# EAGLE design schem (EAGLE 7.6.0)
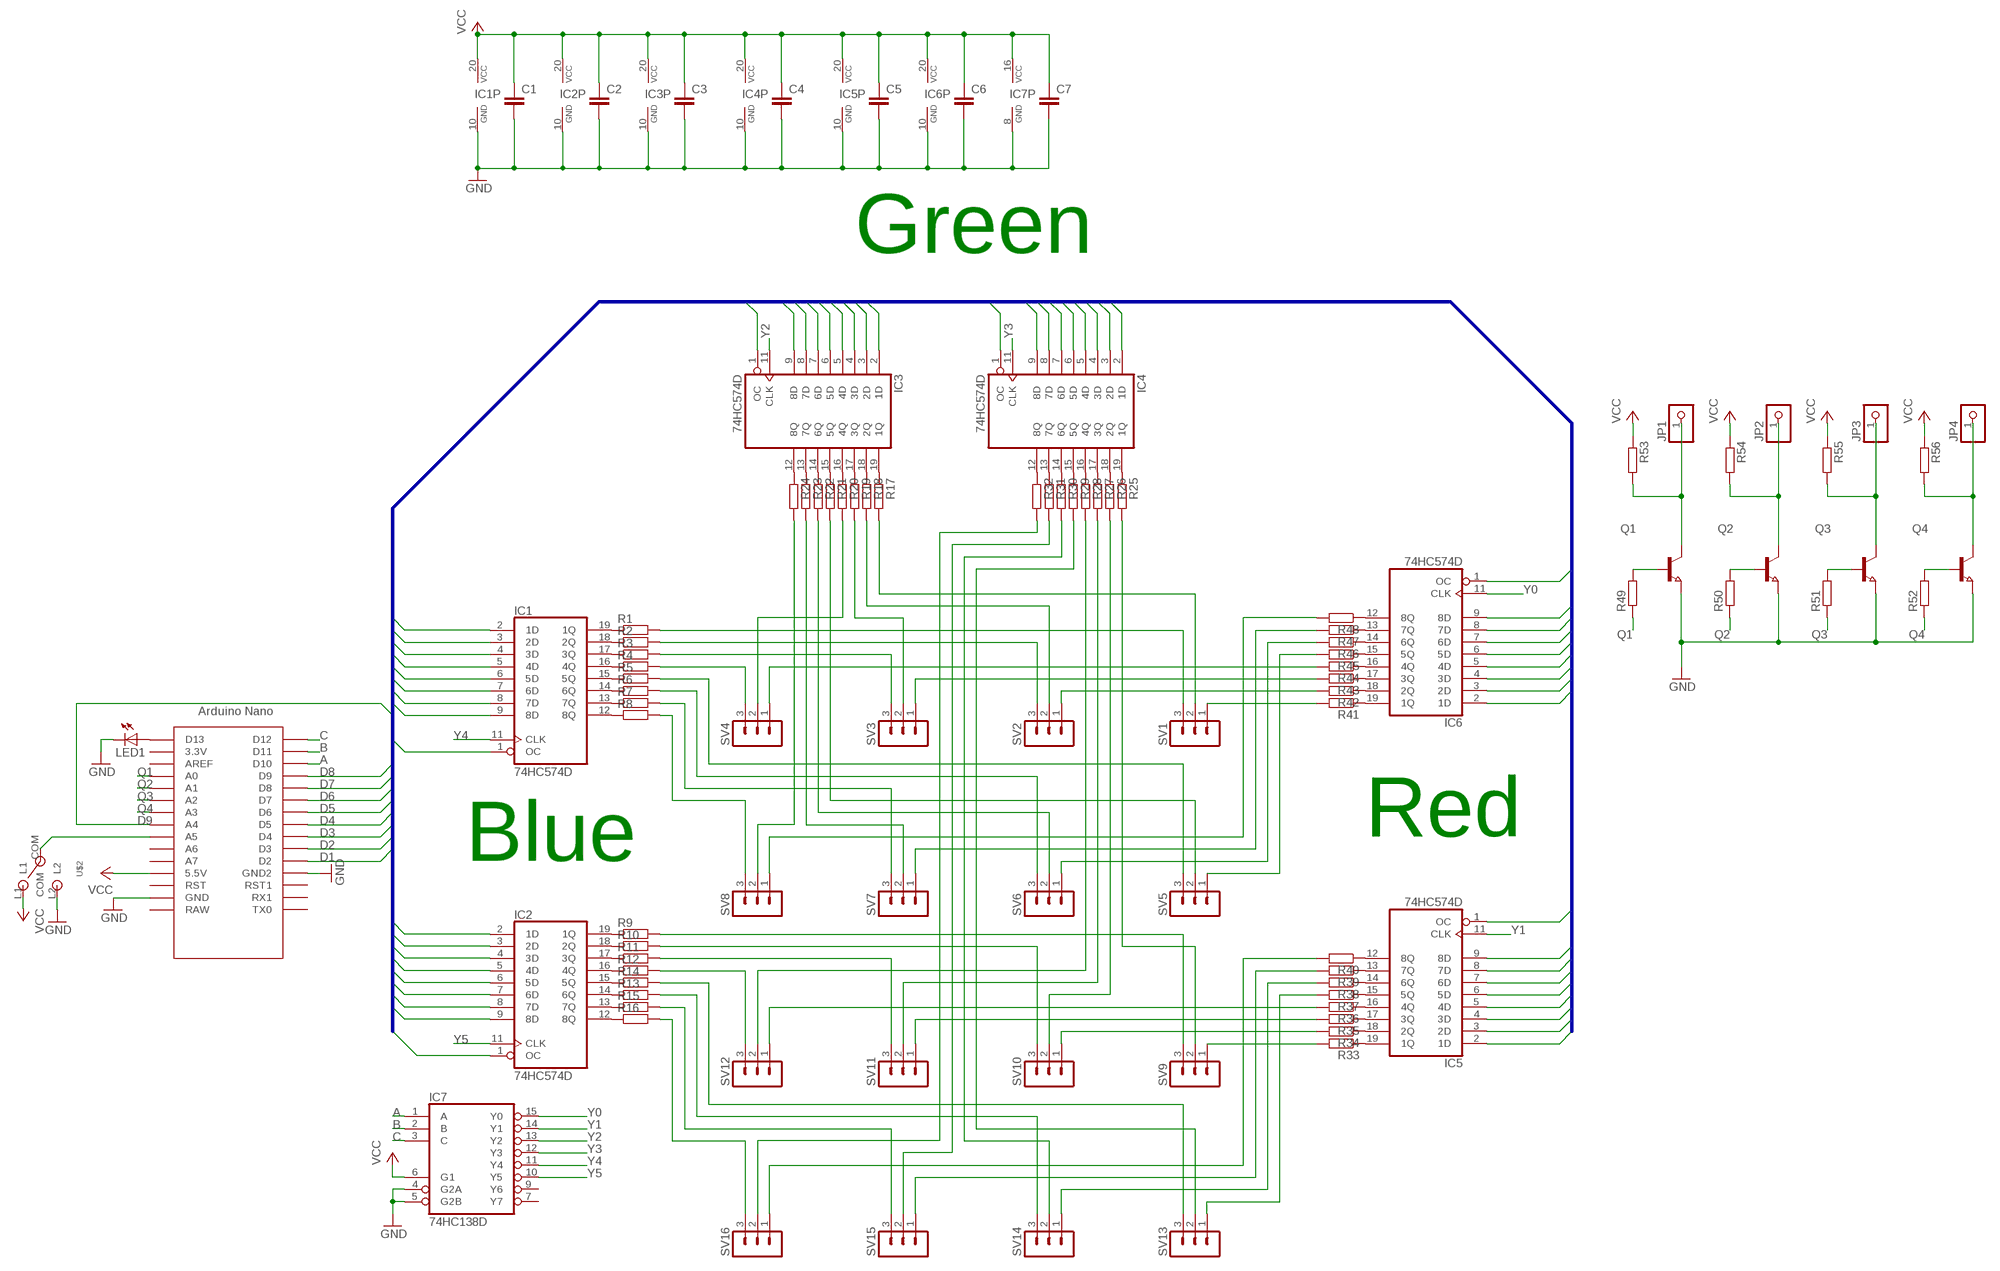
[diagram p0: schematic, sheet 1]

## Parts
C1  C-EUC0805  [C0805]
C2  C-EUC0805  [C0805]
C3  C-EUC0805  [C0805]
C4  C-EUC0805  [C0805]
C5  C-EUC0805  [C0805]
C6  C-EUC0805  [C0805]
C7  C-EUC0805  [C0805]
IC1  74HC574D  [SO20W]
IC2  74HC574D  [SO20W]
IC3  74HC574D  [SO20W]
IC4  74HC574D  [SO20W]
IC5  74HC574D  [SO20W]
IC6  74HC574D  [SO20W]
IC7  74HC138D  [SO16]
JP1  PINHD-1X1  [1X01]
JP2  PINHD-1X1  [1X01]
JP3  PINHD-1X1  [1X01]
JP4  PINHD-1X1  [1X01]
LED1  LEDCHIP-LED0805  [CHIP-LED0805]
Q1  NPN-TRANSISTOR_SOT23  [SOT23]
Q2  NPN-TRANSISTOR_SOT23  [SOT23]
Q3  NPN-TRANSISTOR_SOT23  [SOT23]
Q4  NPN-TRANSISTOR_SOT23  [SOT23]
R1  R-EU_R0805  [R0805]
R2  R-EU_R0805  [R0805]
R3  R-EU_R0805  [R0805]
R4  R-EU_R0805  [R0805]
R5  R-EU_R0805  [R0805]
R6  R-EU_R0805  [R0805]
R7  R-EU_R0805  [R0805]
R8  R-EU_R0805  [R0805]
R9  R-EU_R0805  [R0805]
R10  R-EU_R0805  [R0805]
R11  R-EU_R0805  [R0805]
R12  R-EU_R0805  [R0805]
R13  R-EU_R0805  [R0805]
R14  R-EU_R0805  [R0805]
R15  R-EU_R0805  [R0805]
R16  R-EU_R0805  [R0805]
R17  R-EU_R0805  [R0805]
R18  R-EU_R0805  [R0805]
R19  R-EU_R0805  [R0805]
R20  R-EU_R0805  [R0805]
R21  R-EU_R0805  [R0805]
R22  R-EU_R0805  [R0805]
R23  R-EU_R0805  [R0805]
R24  R-EU_R0805  [R0805]
R25  R-EU_R0805  [R0805]
R26  R-EU_R0805  [R0805]
R27  R-EU_R0805  [R0805]
R28  R-EU_R0805  [R0805]
R29  R-EU_R0805  [R0805]
R30  R-EU_R0805  [R0805]
R31  R-EU_R0805  [R0805]
R32  R-EU_R0805  [R0805]
R33  R-EU_R0805  [R0805]
R34  R-EU_R0805  [R0805]
R35  R-EU_R0805  [R0805]
R36  R-EU_R0805  [R0805]
R37  R-EU_R0805  [R0805]
R38  R-EU_R0805  [R0805]
R39  R-EU_R0805  [R0805]
R40  R-EU_R0805  [R0805]
R41  R-EU_R0805  [R0805]
R42  R-EU_R0805  [R0805]
R43  R-EU_R0805  [R0805]
R44  R-EU_R0805  [R0805]
R45  R-EU_R0805  [R0805]
R46  R-EU_R0805  [R0805]
R47  R-EU_R0805  [R0805]
R48  R-EU_R0805  [R0805]
R49  R-EU_R0805  [R0805]
R50  R-EU_R0805  [R0805]
R51  R-EU_R0805  [R0805]
R52  R-EU_R0805  [R0805]
R53  R-EU_R0805  [R0805]
R54  R-EU_R0805  [R0805]
R55  R-EU_R0805  [R0805]
R56  R-EU_R0805  [R0805]
SV1  MA03-1  [MA03-1]
SV2  MA03-1  [MA03-1]
SV3  MA03-1  [MA03-1]
SV4  MA03-1  [MA03-1]
SV5  MA03-1  [MA03-1]
SV6  MA03-1  [MA03-1]
SV7  MA03-1  [MA03-1]
SV8  MA03-1  [MA03-1]
SV9  MA03-1  [MA03-1]
SV10  MA03-1  [MA03-1]
SV11  MA03-1  [MA03-1]
SV12  MA03-1  [MA03-1]
SV13  MA03-1  [MA03-1]
SV14  MA03-1  [MA03-1]
SV15  MA03-1  [MA03-1]
SV16  MA03-1  [MA03-1]
U$1  NANO  [NANO]
U$2  MSK-12C02_SMD_SPDT_SWITCH  [MSK-12C02]

## Nets
A: IC7.1(A) U$1.D10
B: IC7.2(B) U$1.D11
C: IC7.3(C) U$1.D12
D1: IC1.2(1D) IC2.2(1D) IC3.2(1D) IC4.2(1D) IC5.2(1D) IC6.2(1D) U$1.D2
D2: IC1.3(2D) IC2.3(2D) IC3.3(2D) IC4.3(2D) IC5.3(2D) IC6.3(2D) U$1.D3
D3: IC1.4(3D) IC2.4(3D) IC3.4(3D) IC4.4(3D) IC5.4(3D) IC6.4(3D) U$1.D4
D4: IC1.5(4D) IC2.5(4D) IC3.5(4D) IC4.5(4D) IC5.5(4D) IC6.5(4D) U$1.D5
D5: IC1.6(5D) IC2.6(5D) IC3.6(5D) IC4.6(5D) IC5.6(5D) IC6.6(5D) U$1.D6
D6: IC1.7(6D) IC2.7(6D) IC3.7(6D) IC4.7(6D) IC5.7(6D) IC6.7(6D) U$1.D7
D7: IC1.8(7D) IC2.8(7D) IC3.8(7D) IC4.8(7D) IC5.8(7D) IC6.8(7D) U$1.D8
D8: IC1.9(8D) IC2.9(8D) IC3.9(8D) IC4.9(8D) IC5.9(8D) IC6.9(8D) U$1.D9
D9: IC1.1(OC) IC2.1(OC) IC3.1(OC) IC4.1(OC) IC5.1(OC) IC6.1(OC) U$1.A4
GND: C1.2 C2.2 C3.2 C4.2 C5.2 C6.2 C7.2 IC1.10(GND) IC2.10(GND) IC3.10(GND) IC4.10(GND) IC5.10(GND) IC6.10(GND) IC7.4(G2A) IC7.5(G2B) IC7.8(GND) LED1.C Q1.2(E) Q2.2(E) Q3.2(E) Q4.2(E) U$1.GND U$1.GND1(GND2) U$2.L2
N$1: IC1.19(1Q) R1.1
N$2: IC1.18(2Q) R2.1
N$3: IC1.17(3Q) R3.1
N$4: IC1.16(4Q) R4.1
N$5: IC1.15(5Q) R5.1
N$6: IC1.14(6Q) R6.1
N$7: IC1.13(7Q) R7.1
N$8: IC1.12(8Q) R8.1
N$9: IC2.19(1Q) R9.1
N$10: IC2.18(2Q) R10.1
N$11: IC2.17(3Q) R11.1
N$12: IC2.16(4Q) R12.1
N$13: IC2.14(6Q) R13.1
N$14: IC2.15(5Q) R14.1
N$15: IC2.13(7Q) R15.1
N$16: IC2.12(8Q) R16.1
N$17: IC3.19(1Q) R17.1
N$18: IC3.18(2Q) R18.1
N$19: IC3.17(3Q) R19.1
N$20: IC3.16(4Q) R20.1
N$21: IC3.15(5Q) R21.1
N$22: IC3.14(6Q) R22.1
N$23: IC3.13(7Q) R23.1
N$24: IC3.12(8Q) R24.1
N$25: IC4.19(1Q) R25.1
N$26: IC4.18(2Q) R26.1
N$27: IC4.17(3Q) R27.1
N$28: IC4.16(4Q) R28.1
N$29: IC4.15(5Q) R29.1
N$30: IC4.14(6Q) R30.1
N$31: IC4.13(7Q) R31.1
N$32: IC4.12(8Q) R32.1
N$33: IC5.19(1Q) R33.1
N$34: IC5.18(2Q) R34.1
N$35: IC5.17(3Q) R35.1
N$36: IC5.16(4Q) R36.1
N$37: IC5.15(5Q) R37.1
N$38: IC5.14(6Q) R38.1
N$39: IC5.13(7Q) R39.1
N$40: IC5.12(8Q) R40.1
N$41: IC6.19(1Q) R41.1
N$42: IC6.18(2Q) R42.1
N$43: IC6.17(3Q) R43.1
N$44: IC6.16(4Q) R44.1
N$45: IC6.15(5Q) R45.1
N$46: IC6.14(6Q) R46.1
N$47: IC6.13(7Q) R47.1
N$48: IC6.12(8Q) R48.1
N$49: R1.2 SV1.3
N$50: R2.2 SV2.3
N$51: R3.2 SV3.3
N$52: R4.2 SV4.3
N$53: R5.2 SV5.3
N$54: R6.2 SV6.3
N$55: R7.2 SV7.3
N$56: R8.2 SV8.3
N$57: R17.2 SV1.2
N$58: R18.2 SV2.2
N$59: R19.2 SV3.2
N$60: R20.2 SV4.2
N$61: R21.2 SV5.2
N$62: R22.2 SV6.2
N$63: R23.2 SV7.2
N$64: R24.2 SV8.2
N$65: R44.2 SV4.1
N$66: R43.2 SV3.1
N$67: R42.2 SV2.1
N$68: R41.2 SV1.1
N$69: R48.2 SV8.1
N$70: R9.2 SV9.3
N$71: R47.2 SV7.1
N$72: R46.2 SV6.1
N$73: R45.2 SV5.1
N$74: R10.2 SV10.3
N$75: R11.2 SV11.3
N$76: R12.2 SV12.3
N$77: R28.2 SV12.2
N$78: R27.2 SV11.2
N$79: R26.2 SV10.2
N$80: R25.2 SV9.2
N$81: R36.2 SV12.1
N$82: R35.2 SV11.1
N$83: R34.2 SV10.1
N$84: R33.2 SV9.1
N$85: R14.2 SV13.3
N$86: R13.2 SV14.3
N$87: R15.2 SV15.3
N$88: R16.2 SV16.3
N$89: R32.2 SV16.2
N$90: R31.2 SV15.2
N$91: R30.2 SV14.2
N$92: R29.2 SV13.2
N$93: R40.2 SV16.1
N$94: R39.2 SV15.1
N$95: R38.2 SV14.1
N$96: R37.2 SV13.1
N$97: U$1.A5 U$2.COM
N$98: JP1.1 Q1.3(C) R53.2
N$99: JP2.1 Q2.3(C) R54.2
N$100: JP3.1 Q3.3(C) R55.2
N$101: JP4.1 Q4.3(C) R56.2
N$102: Q1.1(B) R49.2
N$103: Q2.1(B) R50.2
N$104: Q3.1(B) R51.2
N$105: Q4.1(B) R52.2
N$106: LED1.A U$1.D13
Q1: R49.1 U$1.A0
Q2: R50.1 U$1.A1
Q3: R51.1 U$1.A2
Q4: R52.1 U$1.A3
VCC: C1.1 C2.1 C3.1 C4.1 C5.1 C6.1 C7.1 IC1.20(VCC) IC2.20(VCC) IC3.20(VCC) IC4.20(VCC) IC5.20(VCC) IC6.20(VCC) IC7.6(G1) IC7.16(VCC) R53.1 R54.1 R55.1 R56.1 U$1.5V(5.5V) U$2.L1
Y0: IC6.11(CLK) IC7.15(Y0)
Y1: IC5.11(CLK) IC7.14(Y1)
Y2: IC3.11(CLK) IC7.13(Y2)
Y3: IC4.11(CLK) IC7.12(Y3)
Y4: IC1.11(CLK) IC7.11(Y4)
Y5: IC2.11(CLK) IC7.10(Y5)
Unconnected: IC7.7(Y7) IC7.9(Y6) U$1.3.3V U$1.A6 U$1.A7 U$1.AREF U$1.ICSP1 U$1.ICSP2 U$1.ICSP3 U$1.ICSP4 U$1.ICSP5 U$1.ICSP6 U$1.RAW U$1.RST U$1.RST1 U$1.RX1 U$1.TX0

## Buses
D[1..9]

## Notes on the sheet
- Green
- Red
- Blue

## Library data of the parts
C1-C7 = resistor:C-EU: CAPACITOR, European symbol
IC1-IC6 = 74xx-eu:74*574: 8-bit D type FLIP FLOP bus driver
IC7 = 74xx-eu:74*138: 3-line to 8-line DECODER/DEMULTIPLEXER
JP1-JP4 = pinhead:PINHD-1X1: PIN HEADER
LED1 = led:LED: LED OSRAM: - CHIPLED LG R971, LG N971, LY N971, LG Q971, LY Q971, LO R971, LY R971 LH N974, LH R974 LS Q976, LO Q976, LY Q976 LO Q996 - Hyper CHIPLED LW Q18S LB Q993, LB Q99A, LB R99A - SideLED LS A670, LO A670, LY A670, LG A670, LP A670 LB A673, LV A673, LT A673, LW A673 LH A674 LY A675 LS A676, LA A676, LO A676, LY A676, LW A676 LS A679, LY A679, LG A679 - Hyper Micro SIDELED® LS Y876, LA Y876, LO Y876, LY Y876 LT Y87S - SmartLED LW L88C, LW L88S LB L89C, LB L89S, LG L890 LS L89K, LO L89K, LY L89K LS L896, LA L896, LO L896, LY L896 - TOPLED LS T670, LO T670, LY T670, LG T670, LP T670 LSG T670, LSP T670, LSY T670, LOP T670, LYG T670 LG T671, LOG T671, LSG T671 LB T673, LV T673, LT T673, LW T673 LH T674 LS T676, LA T676, LO T676, LY T676, LB T676, LH T676, LSB T676, LW T676 LB T67C, LV T67C, LT T67C, LS T67K, LO T67K, LY T67K, LW E67C LS E67B, LA E67B, LO E67B, LY E67B, LB E67C, LV E67C, LT E67C LW T67C LS T679, LY T679, LG T679 LS T770, LO T770, LY T770, LG T770, LP T770 LB T773, LV T773, LT T773, LW T773 LH T774 LS E675, LA E675, LY E675, LS T675 LS T776, LA T776, LO T776, LY T776, LB T776 LHGB T686 LT T68C, LB T68C - Hyper Mini TOPLED® LB M676 - Mini TOPLED Santana® LG M470 LS M47K, LO M47K, LY M47K Source: http://www.osram.convergy.de LUXEON: - LUMILED® LXK2-PW12-R00, LXK2-PW12-S00, LXK2-PW14-U00, LXK2-PW14-V00 LXK2-PM12-R00, LXK2-PM12-S00, LXK2-PM14-U00 LXK2-PE12-Q00, LXK2-PE12-R00, LXK2-PE12-S00, LXK2-PE14-T00, LXK2-PE14-U00 LXK2-PB12-K00, LXK2-PB12-L00, LXK2-PB12-M00, LXK2-PB14-N00, LXK2-PB14-P00, LXK2-PB14-Q00 LXK2-PR12-L00, LXK2-PR12-M00, LXK2-PR14-Q00, LXK2-PR14-R00 LXK2-PD12-Q00, LXK2-PD12-R00, LXK2-PD12-S00 LXK2-PH12-R00, LXK2-PH12-S00 LXK2-PL12-P00, LXK2-PL12-Q00, LXK2-PL12-R00 Source: www.luxeon.com KINGBRIGHT: KA-3528ASYC Source: www.kingbright.com
Q1-Q4 = semicon-smd-ipc:NPN-TRANSISTOR_: NPN TRANSISTOR
R1-R56 = resistor:R-EU_: RESISTOR, European symbol
SV1-SV16 = con-lstb:MA03-1: PIN HEADER; OC_FARNELL: unknown; OC_NEWARK: unknown
U$1 = Arduino-clone:NANO: Arduino Nano
U$2 = MSK-12C02 SMD Micro Slider Switch SPDT:MSK-12C02_SMD_SPDT_SWITCH: Footprint of the VIMEX MSK-12C02 SPDT SMD Switch Created by mzst on 17-Jan-2016

## Board
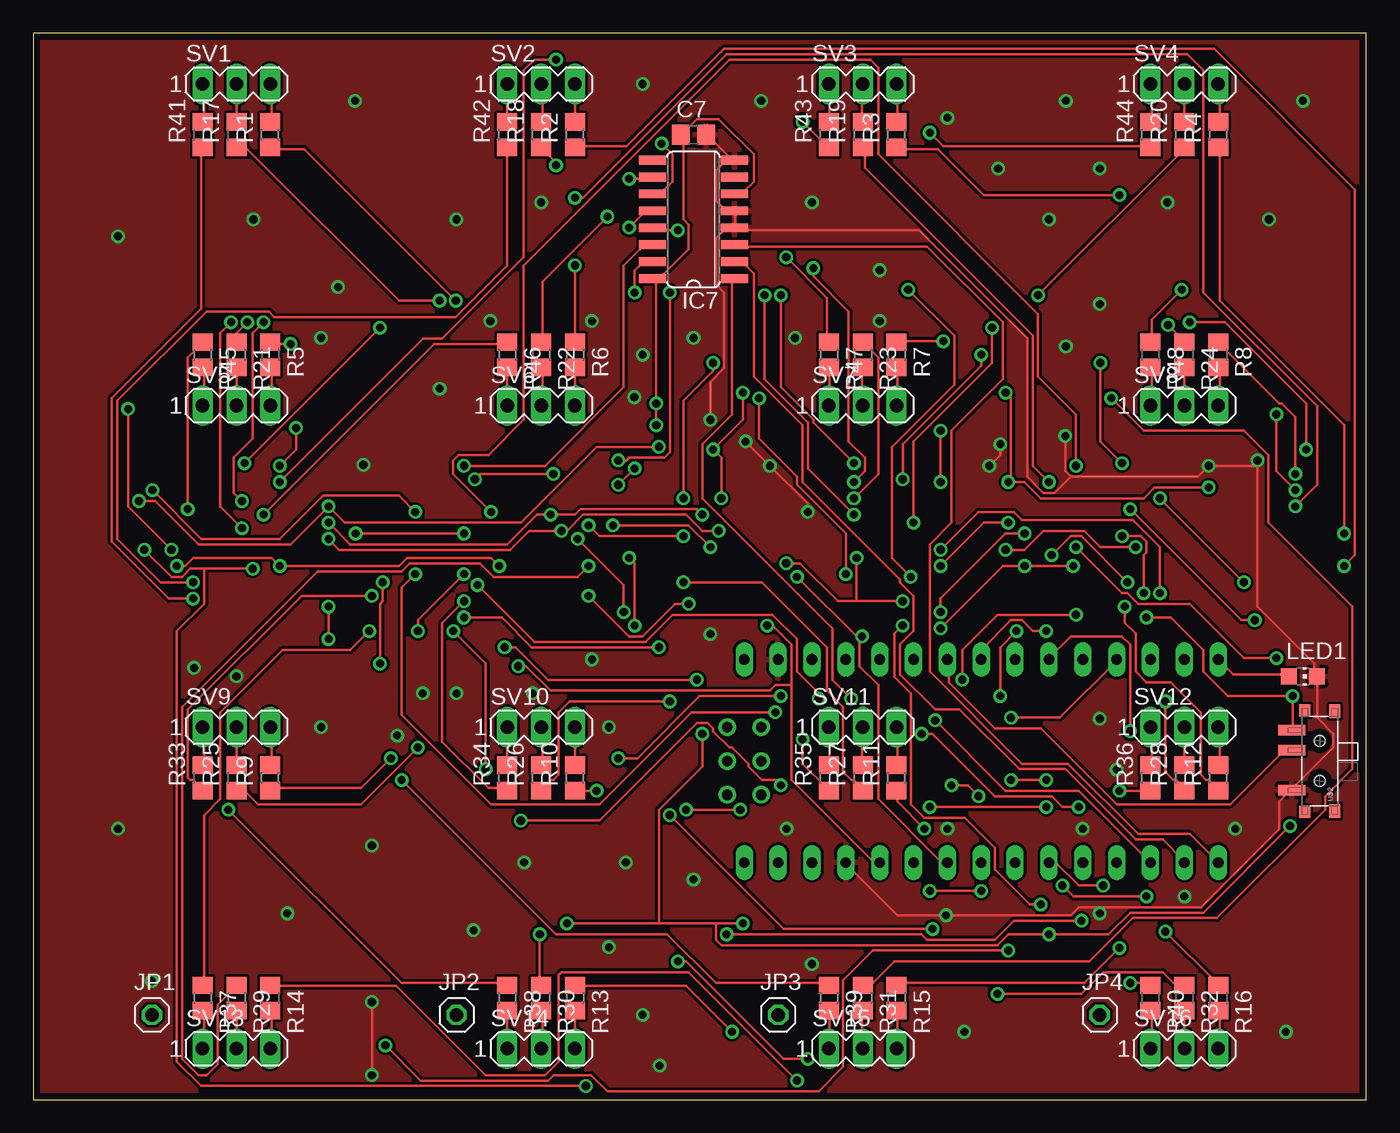
[diagram p1: board, top side]
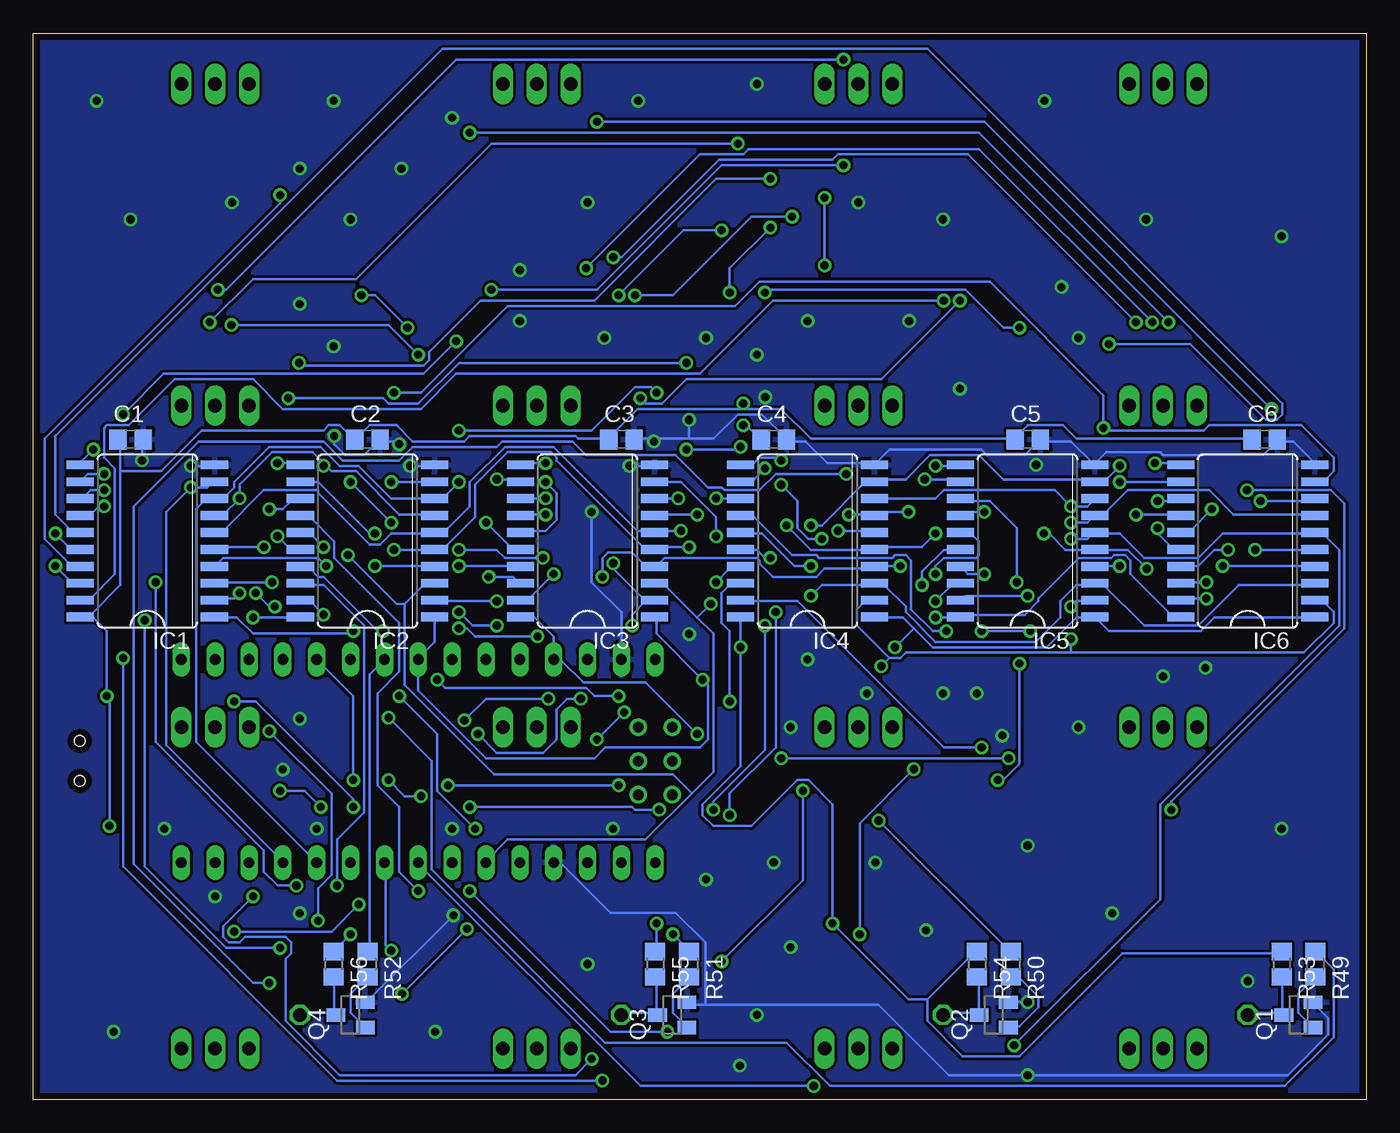
[diagram p2: board, bottom side, seen from below]

Size 100 x 80 mm. Coordinates in mm from the lower left corner, seen from the top.
Outline: 0,0 100,0 100,80 0,80 0,0
Copper layers (1*16): Top 0.035mm / dielectric 1.5mm / Bottom 0.035mm
Design rules "default *": minimum track width 8mil, minimum drill 24mil, track to track 8mil, track to pad 8mil, pad to pad 8mil, via to via 8mil, smd to smd 8mil, copper to edge 20mil, drill to drill 8mil, minimum pad ring 10mil, minimum via ring 8mil, stop-mask expansion 4mil, vias tented up to drill 0mil, thermal gap 10mil

### Footprints (pad centres in the part's own frame; a part is rotated, then mirrored left to right if it is on the bottom)
C0805 = smd 1.3 x 1.5: 1 -0.95,0; 2 0.95,0
SO20W = smd 0.66 x 2.032: 1 -5.715,-5.029; 2 -4.445,-5.029; 3 -3.175,-5.029; 4 -1.905,-5.029; 5 -0.635,-5.029; 6 0.635,-5.029; 7 1.905,-5.029; 8 3.175,-5.029; 9 4.445,-5.029; 10 5.715,-5.029; 11 5.715,5.029; 12 4.445,5.029; 13 3.175,5.029; 14 1.905,5.029; 15 0.635,5.029; 16 -0.635,5.029; 17 -1.905,5.029; 18 -3.175,5.029; 19 -4.445,5.029; 20 -5.715,5.029
SO16 = smd 0.66 x 2.032: 1 -4.445,-3.073; 2 -3.175,-3.073; 3 -1.905,-3.073; 4 -0.635,-3.073; 5 0.635,-3.073; 6 1.905,-3.073; 7 3.175,-3.073; 8 4.445,-3.073; 9 4.445,3.073; 10 3.175,3.073; 11 1.905,3.073; 12 0.635,3.073; 13 -0.635,3.073; 14 -1.905,3.073; 15 -3.175,3.073; 16 -4.445,3.073
1X01 = drill 1.016 octagon: 1 0,0
CHIP-LED0805 = smd 1.2 x 1.2: A 0,-1.05; C 0,1.05
SOT23 = smd 1 x 1.4: 1 -0.95,-1.1; 2 0.95,-1.1; 3 0,1.1
R0805 = smd 1.3 x 1.5: 1 -0.95,0; 2 0.95,0
MA03-1 = drill 1.016 long: 1 -2.54,0; 2 0,0; 3 2.54,0
NANO = drill 0.8 long: 3.3V -10.16,24.13; 5V -10.16,-1.27; A0 -10.16,19.05; A1 -10.16,16.51; A2 -10.16,13.97; A3 -10.16,11.43; A4 -10.16,8.89; A5 -10.16,6.35; A6 -10.16,3.81; A7 -10.16,1.27; AREF -10.16,21.59; D2 5.08,1.27; D3 5.08,3.81; D4 5.08,6.35; D5 5.08,8.89; D6 5.08,11.43; D7 5.08,13.97; D8 5.08,16.51; D9 5.08,19.05; D10 5.08,21.59; D11 5.08,24.13; D12 5.08,26.67; D13 -10.16,26.67; GND -10.16,-6.35; GND1 5.08,-1.27; RAW -10.16,-8.89; RST -10.16,-3.81; RST1 5.08,-3.81; RX1 5.08,-6.35; TX0 5.08,-8.89 | drill 0.8: ICSP1 -5.08,-10.16; ICSP2 -5.08,-7.62; ICSP3 -2.54,-10.16; ICSP4 -2.54,-7.62; ICSP5 0,-10.16; ICSP6 0,-7.62
MSK-12C02 = smd 0.8 x 2: COM 0.823,2.1; L1 2.323,2.1; L2 -2.177,2.1 | smd 1 x 0.8: GND@1 -3.75,-1.125; GND@4 3.75,-1.125 | smd 0.9 x 0.8: GND@2 -3.8,1.125; GND@3 3.8,1.125 | hole 0.8: -1.5,0; 1.5,0

### Placement (x,y rotation side)
C1  92.71,49.53 0 bottom
C2  74.93,49.53 0 bottom
C3  55.88,49.53 0 bottom
C4  44.45,49.53 0 bottom
C5  25.4,49.53 0 bottom
C6  7.62,49.53 0 bottom
C7  49.53,72.39 0 top
IC1  91.44,41.91 90 bottom
IC2  74.93,41.91 90 bottom
IC3  58.42,41.91 90 bottom
IC4  41.91,41.91 90 bottom
IC5  25.4,41.91 90 bottom
IC6  8.89,41.91 90 bottom
IC7  49.53,66.04 90 top
JP1  8.89,6.35 0 top
JP2  31.75,6.35 0 top
JP3  55.88,6.35 0 top
JP4  80.01,6.35 0 top
LED1  95.25,31.75 270 top
Q1  5.08,6.35 90 bottom
Q2  27.94,6.35 90 bottom
Q3  52.07,6.35 90 bottom
Q4  76.2,6.35 90 bottom
R1  17.78,72.39 90 top
R2  40.64,72.39 90 top
R3  64.77,72.39 90 top
R4  88.9,72.39 90 top
R5  17.78,55.88 270 top
R6  40.64,55.88 270 top
R7  64.77,55.88 270 top
R8  88.9,55.88 270 top
R9  17.78,24.13 90 top
R10  40.64,24.13 90 top
R11  64.77,24.13 90 top
R12  88.9,24.13 90 top
R13  40.64,7.62 270 top
R14  17.78,7.62 270 top
R15  64.77,7.62 270 top
R16  88.9,7.62 270 top
R17  15.24,72.39 90 top
R18  38.1,72.39 90 top
R19  62.23,72.39 90 top
R20  86.36,72.39 90 top
R21  15.24,55.88 270 top
R22  38.1,55.88 270 top
R23  62.23,55.88 270 top
R24  86.36,55.88 270 top
R25  15.24,24.13 90 top
R26  38.1,24.13 90 top
R27  62.23,24.13 90 top
R28  86.36,24.13 90 top
R29  15.24,7.62 270 top
R30  38.1,7.62 270 top
R31  62.23,7.62 270 top
R32  86.36,7.62 270 top
R33  12.7,24.13 90 top
R34  35.56,24.13 90 top
R35  59.69,24.13 90 top
R36  83.82,24.13 90 top
R37  12.7,7.62 270 top
R38  35.56,7.62 270 top
R39  59.69,7.62 270 top
R40  83.82,7.62 270 top
R41  12.7,72.39 90 top
R42  35.56,72.39 90 top
R43  59.69,72.39 90 top
R44  83.82,72.39 90 top
R45  12.7,55.88 270 top
R46  35.56,55.88 270 top
R47  59.69,55.88 270 top
R48  83.82,55.88 270 top
R49  3.81,10.16 270 bottom
R50  26.67,10.16 270 bottom
R51  50.8,10.16 270 bottom
R52  74.93,10.16 270 bottom
R53  6.35,10.16 270 bottom
R54  29.21,10.16 270 bottom
R55  53.34,10.16 270 bottom
R56  77.47,10.16 270 bottom
SV1  15.24,76.2 0 top
SV2  38.1,76.2 0 top
SV3  62.23,76.2 0 top
SV4  86.36,76.2 0 top
SV5  15.24,52.07 0 top
SV6  38.1,52.07 0 top
SV7  62.23,52.07 0 top
SV8  86.36,52.07 0 top
SV9  15.24,27.94 0 top
SV10  38.1,27.94 0 top
SV11  62.23,27.94 0 top
SV12  86.36,27.94 0 top
SV13  15.24,3.81 0 top
SV14  38.1,3.81 0 top
SV15  62.23,3.81 0 top
SV16  86.36,3.81 0 top
U$1  62.23,22.86 270 top
U$2  96.52,25.4 90 top

### Tracks (layer width: path | path; a pad name or v marks a point on that pad's centre or on a via)
A  (via drill 0.61)
  Top 0.203: v61.37,30.07 59.94,31.5 59.94,35.36 50.19,45.11 50.19,49.17 52.43,51.41 52.43,61.57 IC7.1 | v67.67,28.45 72.95,23.16 78.44,23.16 U$1.D10
  Bottom 0.203: v61.37,30.07 66.04,30.07 v67.67,28.45
B
  Top 0.203: IC7.2 52.63,62.79 53.24,62.79 54.05,61.98 54.05,54.25 57.71,50.6 57.71,46.33 65.02,39.01 65.02,38.81 66.04,37.8 66.04,35.15 65.02,34.14 65.02,31.9 67.67,29.26 69.49,29.26 73.97,24.79 77.42,24.79 82.7,19.51 84.73,19.51 86.36,17.88 U$1.D11
C
  Top 0.203: U$1.D12 86.77,19.91 82.91,19.91 77.62,25.2 74.17,25.2 67.26,32.11 67.26,41.66 68.89,43.28 68.89,50.19 72.75,54.05 72.75,58.32 67.06,64.01 52.63,64.01 IC7.3
D1  (via drill 0.61)
  Top 0.203: v22.15,34.54 v22.15,36.98 | v55.07,35.56 55.47,35.56 56.9,34.14 56.9,31.09 | 56.9,31.09 56.9,23.98 62.99,17.88 63.4,17.88 U$1.D2 | 61.77,37.39 60.35,37.39 57.51,40.23 v56.49,40.23 | 61.77,37.39 v65.23,37.39 | v84.53,38 84.53,41.45 82.5,43.48 74.17,43.48 73.56,44.09 70.92,44.09 v68.07,41.25 | 61.77,37.39 v61.77,40.64 | v36.37,32.51 36.98,32.51 38.81,30.68 55.27,30.68 55.68,31.09 56.9,31.09
  Bottom 0.203: 22.15,33.53 34.54,33.53 34.95,33.12 35.76,33.12 | 22.15,33.53 4.67,33.53 2.44,35.76 2.44,36.58 3.25,37.39 3.86,37.39 IC6.2 | 35.76,33.12 38.2,35.56 38.2,36.78 37.59,37.39 36.98,37.39 IC4.2 | v22.15,36.98 21.74,37.39 20.52,37.39 IC5.2 | 22.15,33.53 v22.15,34.54 | 54.05,37.39 53.44,37.39 IC3.2 54.05,37.39 | 54.05,37.39 55.07,36.37 v55.07,35.56 | v65.23,37.39 69.9,37.39 IC2.2 | v56.49,40.23 56.49,39.83 54.05,37.39 | v84.53,38 84.94,37.59 86.36,37.59 IC1.2 | v68.07,41.25 65.23,41.25 64.62,40.64 v61.77,40.64 | v36.37,32.51 35.76,33.12
D2  (via drill 0.61)
  Top 0.203: v82.09,38.81 78.64,42.27 77.83,42.27 v76.4,40.84 | v41.66,37.8 44.7,34.75 45.72,34.75 48.16,37.19 v49.17,37.19
  Bottom 0.203: IC6.3 3.86,38.61 9.55,38.61 12.6,35.56 16.66,35.56 19.71,38.61 20.32,38.61 IC5.3 20.52,38.61 21.74,38.61 22.96,37.39 22.96,36.17 24.79,34.34 32.31,34.34 34.54,36.58 34.54,36.98 36.17,38.61 36.78,38.61 IC4.3 36.98,38.61 40.84,38.61 v41.66,37.8 | 50.19,36.17 48.97,34.95 48.97,24.59 50.6,22.96 | 50.19,36.17 52.63,38.61 53.24,38.61 IC3.3 | 50.6,22.96 54.05,19.51 64.41,19.51 66.04,17.88 U$1.D3 | 72.14,37.19 70.71,38.61 69.9,38.61 IC2.3 | 72.14,37.19 72.14,31.09 65.43,24.38 52.02,24.38 50.6,22.96 | v82.09,38.81 86.36,38.81 IC1.3 | v76.4,40.84 72.75,37.19 72.14,37.19 | 50.19,36.17 v49.17,37.19
D3  (via drill 0.61)
  Top 0.203: v78.03,40.03 v74.37,40.03 72.75,40.03 v68.07,35.36 | v10.77,40.03 11.38,40.03 11.99,40.64 17.88,40.64 v18.49,40.03 27.43,40.03 28.04,40.64 34.34,40.64 v34.95,40.03 | 61.98,34.54 61.98,32.51 63.4,31.09 63.4,22.55 68.07,17.88 68.48,17.88 U$1.D4 | v57.3,39.22 61.98,34.54 | 61.98,34.54 v62.18,34.75
  Bottom 0.203: v74.37,40.03 69.9,40.03 IC2.4 | v78.03,40.03 78.64,40.64 85.75,40.64 86.36,40.03 IC1.4 | v10.77,40.03 3.86,40.03 IC6.4 | v18.49,40.03 20.32,40.03 IC5.4 | v57.3,39.22 57.3,40.64 56.9,41.05 55.07,41.05 54.05,40.03 53.44,40.03 IC3.4 53.24,40.03 52.63,40.64 45.72,40.64 45.52,40.44 45.52,40.23 44.5,39.22 41.25,39.22 40.64,39.83 36.98,39.83 IC4.4 36.78,40.03 v34.95,40.03 | v68.07,35.36 67.46,35.36 66.85,34.75 v62.18,34.75
D4  (via drill 0.61)
  Top 0.203: v82.7,41.45 80.06,41.45 78.84,42.67 75.79,42.67 74.37,41.25 v72.95,41.25 | v8.33,41.25 10.36,39.22 11.18,39.22 11.79,39.83 12.8,39.83 | v16.46,39.83 12.8,39.83 | v24.18,42.47 v32.31,42.47 | v41.45,1.02 12.6,1.02 10.77,2.85 10.77,35.15 12.8,37.19 12.8,39.83 | v50.8,41.45 49.17,43.08 v43.48,43.08
  Bottom 0.203: v82.7,41.45 86.36,41.45 IC1.5 | v72.95,41.25 69.9,41.25 IC2.5 69.9,41.45 69.09,41.45 66.85,43.69 66.85,46.13 64.41,48.56 61.16,48.56 60.76,48.16 60.76,47.95 54.25,41.45 53.44,41.45 IC3.5 53.24,41.45 v50.8,41.45 | v8.33,41.25 3.86,41.25 IC6.5 | v16.46,39.83 17.88,41.25 20.32,41.25 IC5.5 20.52,41.25 22.55,41.25 23.77,42.47 v24.18,42.47 | v32.31,42.47 33.33,41.45 36.78,41.45 IC4.5 36.98,41.25 41.66,41.25 v43.48,43.08 | v41.45,1.02 54.46,1.02 71.12,17.68 U$1.D5
D5  (via drill 0.61)
  Top 0.203: v51.41,42.67 50.19,42.67 48.97,43.89 41.25,43.89 40.03,42.67 v39.62,42.67 37.19,42.67 35.76,41.25 22.96,41.25 v22.15,42.06 | v73.15,11.18 62.99,11.18 60.76,8.94 60.76,2.44 58.93,0.61 43.08,0.61 41.86,1.83 39.01,1.83 38.61,1.42 29.06,1.42 v26.42,4.06
  Bottom 0.203: v39.62,42.67 36.98,42.67 IC4.6 | v51.41,42.67 53.24,42.67 IC3.6 53.44,42.67 54.66,42.67 60.96,48.97 64.62,48.97 67.26,46.33 67.26,44.5 69.09,42.67 69.9,42.67 IC2.6 69.9,42.47 73.15,42.47 73.97,41.66 74.78,41.66 78.64,45.52 78.64,45.72 82.7,45.72 85.75,42.67 86.36,42.67 IC1.6 | 3.86,42.47 10.77,42.47 12.6,40.64 16.66,40.64 18.49,42.47 20.32,42.47 IC5.6 20.52,42.47 20.93,42.06 v22.15,42.06 | v73.15,11.18 73.56,11.58 73.56,17.68 U$1.D6 | v26.42,4.06 15.44,15.04 15.44,22.15 2.03,35.56 2.03,41.25 3.25,42.47 3.86,42.47 | 3.86,42.47 IC6.6
D6  (via drill 0.61)
  Top 0.203: v80.26,16.05 78.44,16.05 76.81,17.68 76.2,17.68 U$1.D7 | v84.53,45.11 v90.83,38.81 | v50.19,43.89 49.78,44.3 41.05,44.3 40.64,43.89 v38.81,43.89 37.8,43.89 35.56,41.66 23.77,41.66 v22.15,43.28 | v78.23,47.55 78.23,51.41 75.39,54.25 75.39,58.93 63.4,70.92 63.4,77.42 62.79,78.03 52.22,78.03 36.78,62.59 36.78,51 34.14,48.36 31.9,48.36 31.5,47.95 31.5,46.94 v34.34,44.09
  Bottom 0.203: 78.23,47.75 79.05,48.56 82.09,48.56 84.53,46.13 v84.53,45.11 85.75,43.89 86.36,43.89 IC1.7 | 78.23,47.75 77.62,47.14 75.79,47.14 72.54,43.89 69.9,43.89 IC2.7 | v80.26,16.05 81.69,16.05 82.7,17.07 82.7,18.69 90.83,26.82 v90.83,38.81 | v38.81,43.89 36.98,43.89 IC4.7 36.78,43.89 36.58,44.09 v34.34,44.09 | v50.19,43.89 53.24,43.89 IC3.7 | IC6.7 3.86,43.89 9.96,43.89 11.79,45.72 17.88,45.72 19.71,43.89 20.32,43.89 IC5.7 20.52,43.69 20.93,43.28 v22.15,43.28 | v78.23,47.55 78.23,47.75
D7  (via drill 0.61)
  Top 0.203: v7.92,44.91 9.14,44.91 12.39,41.66 19.3,41.66 v22.15,44.5 23.37,43.28 36.58,43.28 42.27,48.97 v46.94,48.97 | v51.61,45.11 51.61,48.16 v51,48.77 53.24,51 v53.24,53.03 | v68.07,50.19 v68.07,46.33
  Bottom 0.203: 69.9,45.11 73.15,45.11 75.59,47.55 77.01,47.55 78.44,48.97 82.3,48.97 84.94,46.33 84.94,45.92 85.75,45.11 86.36,45.11 IC1.8 86.56,44.91 87.17,44.91 87.78,44.3 87.78,26.82 U$1.D8 | v7.92,44.91 3.86,44.91 IC6.8 | IC5.8 20.52,44.91 20.93,44.5 v22.15,44.5 23.37,45.72 31.7,45.72 32.31,45.11 36.78,45.11 IC4.8 | v51.61,45.11 53.24,45.11 IC3.8 | v51,48.77 47.14,48.77 v46.94,48.97 | 69.9,45.11 69.29,45.11 v68.07,46.33 | v68.07,50.19 58.12,50.19 54.86,53.44 53.65,53.44 v53.24,53.03 | 69.9,45.11 IC2.8
D8  (via drill 0.61)
  Top 0.203: 73.36,46.33 74.37,46.33 75.59,45.11 83.31,45.11 84.12,45.92 v88.19,45.92 | v19.71,50.39 19.71,48.77 v18.49,47.55 | v48.77,42.27 42.47,42.27 v41.66,43.08 | 73.36,46.33 73.36,52.63 v72.95,53.03 | 73.36,46.33 v73.15,46.33
  Bottom 0.203: v73.15,46.33 69.9,46.33 IC2.9 | IC1.9 86.56,46.33 86.97,45.92 v88.19,45.92 90.02,44.09 90.02,26.62 81.28,17.88 U$1.D9 | v18.49,47.55 19.51,46.53 20.32,46.53 IC5.9 20.52,46.53 27.23,46.53 29.06,48.36 32.72,48.36 34.54,46.53 36.78,46.53 IC4.9 36.98,46.33 37.59,46.33 40.84,43.08 v41.66,43.08 | IC6.9 3.86,46.53 3.05,46.53 2.44,47.14 2.44,48.16 4.88,50.6 11.79,50.6 12.19,50.19 19.51,50.19 v19.71,50.39 19.71,52.83 28.25,61.37 45.52,61.37 47.35,59.54 64.41,59.54 70.92,53.03 v72.95,53.03 | v48.77,42.27 48.77,43.69 51.41,46.33 53.24,46.33 IC3.9
D9  (via drill 0.61)
  Top 0.203: v76,35.15 74.98,35.15 74.17,35.97 73.36,35.97 71.12,33.73 U$1.A4 | v35.36,33.93 36.17,33.93 38.61,31.5 v49.78,31.5
  Bottom 0.203: IC6.1 3.86,36.17 11.38,36.17 12.39,35.15 19.3,35.15 20.32,36.17 IC5.1 20.52,36.17 21.74,36.17 23.98,33.93 32.51,33.93 33.93,35.36 | 33.93,35.36 34.75,36.17 36.78,36.17 IC4.1 | IC3.1 53.24,36.17 53.24,34.95 v49.78,31.5 49.38,31.09 49.38,27.03 49.99,26.42 57.1,26.42 57.91,25.6 66.04,25.6 71.12,30.68 U$1.A4 71.12,33.12 69.9,34.34 IC2.1 | v76,35.15 76.2,34.95 83.52,34.95 84.73,36.17 86.36,36.17 IC1.1 | v35.36,33.93 33.93,35.36
GND  (via drill 0.61)
  Top 0.203: U$1.GND1 60.96,17.68 64.82,13.82 v68.48,13.82 77.83,13.82 78.44,14.43 87.58,14.43 93.47,20.32 93.47,22.35 94.28,23.16 U$2.L2 94.49,23.37 97.54,26.42 97.54,27.43 96.32,28.65 96.32,31.7 LED1.C 96.11,31.9 96.11,32.72 91.85,36.98 91.85,47.55 | v25.4,1.83 v25.4,7.32 | v53.44,49.38 v55.27,47.55 58.12,44.7 v58.12,44.09 | IC7.4 52.63,65.43 52.63,66.65 IC7.5 52.43,66.85 51.82,66.85 51.21,67.46 51.21,69.7 52.22,70.71 | 52.22,70.71 52.43,70.51 IC7.8 52.22,70.71 | 52.22,70.71 50.6,72.34 C7.2 | v72.54,49.17 72.54,48.36 v71.73,47.55 | 91.85,47.55 v88.19,47.55 87.38,46.74 77.83,46.74 | 91.85,47.55 v91.85,47.95 | v77.42,49.78 77.42,47.14 77.83,46.74 | 77.83,46.74 76.61,45.52 75.79,45.52 74.57,46.74 74.57,57.1 66.45,65.23 52.63,65.23 IC7.4 | v50.8,51 50.8,53.85 51.82,54.86 51.82,60.55 51.21,61.16 51.21,64.62 51.82,65.23 52.43,65.23 IC7.4
  Bottom 0.203: v68.48,13.82 74.98,7.32 Q4.2 | 49.58,7.11 50.8,7.11 Q3.2 | 49.58,7.11 36.58,7.11 31.29,1.83 v25.4,1.83 5.89,1.83 2.85,4.88 2.85,6.1 3.86,7.11 Q1.2 | v25.4,7.32 26.82,7.32 Q2.2 | 49.58,7.11 49.58,11.79 51.82,14.02 56.69,14.02 60.35,17.68 60.96,17.68 U$1.GND1 | IC6.10 3.86,47.75 5.49,49.38 6.5,49.38 C6.2 6.71,49.38 7.72,48.36 15.24,48.36 15.44,48.56 19.51,48.56 20.32,47.75 IC5.10 20.52,47.75 22.15,49.38 24.38,49.38 C5.2 24.59,49.38 25.6,48.36 28.45,48.36 28.85,48.77 35.76,48.77 36.78,47.75 IC4.10 36.98,47.75 40.44,47.75 42.06,49.38 43.48,49.38 C4.2 43.48,49.58 45.31,51.41 47.14,51.41 48.97,49.58 50.8,49.58 | 50.8,49.58 53.44,49.58 | 53.44,49.58 54.86,49.58 C3.2 | v55.27,47.55 53.44,47.55 IC3.10 | 53.44,49.58 v53.44,49.38 | U$1.GND 55.88,36.58 58.12,38.81 v58.12,44.09 | v72.54,49.17 72.75,49.38 73.97,49.38 C2.2 74.17,49.38 75.18,48.36 76.61,48.36 77.42,49.17 v77.42,49.78 | v71.73,47.55 69.9,47.55 IC2.10 | v91.85,47.95 91.85,49.38 C1.2 | v88.19,47.55 86.56,47.55 IC1.10 | v50.8,51 50.8,49.58
  other vias: 8.89,8.89 6.35,20.32 6.35,64.77 16.51,66.04 24.13,74.93 25.4,19.05 19.05,13.97 33.02,12.7 36.83,17.78 44.45,17.78 21.59,27.94 43.18,11.43 45.72,6.35 46.99,2.54 49.53,16.51 69.85,5.08 58.42,10.16 93.98,5.08 86.36,15.24 90.17,20.32 22.86,60.96 21.59,57.15 31.75,66.04 38.1,67.31 30.48,53.34 24.77,47.62 34.29,58.42 41.91,58.42 45.72,55.88 45.09,52.7 49.53,57.15 57.15,57.15 63.5,58.42 63.5,62.23 58.42,67.31 54.61,74.93 45.72,76.2 68.58,73.66 72.39,69.85 76.2,66.04 77.47,74.93 80.01,69.85 85.09,67.31 92.71,66.04 95.25,74.93 80.01,59.69 77.47,56.52 56.52,20.32 68.58,20.32 27.3,27.3 29.21,30.48 31.75,30.48 80.01,13.97 78.74,20.32 81.28,24.77 80.01,28.57 41.91,33.02 43.18,27.94 37.47,30.48 50.8,34.92 12.06,32.38 15.24,31.75
  pour Bottom: 0,80.01 100.33,80.01 100.33,0 0,0
  pour Top: 0,80.01 0,0 100.33,0 100.33,80.01
N$1  (via drill 0.61)
  Top 0.203: v31.7,59.94 20.32,71.32 17.88,71.32 R1.1
  Bottom 0.203: v31.7,59.94 44.5,59.94 49.99,54.46 68.28,54.46 70.92,51.82 81.28,51.82 83.52,54.05 89.41,54.05 92.86,50.6 94.49,50.6 94.69,50.39 94.69,48.16 93.88,47.35 93.88,39.42 95.71,37.59 96.32,37.59 IC1.19
N$2  (via drill 0.61)
  Top 0.203: v98.35,40.03 99.16,40.84 99.16,68.28 88.59,78.84 51.82,78.84 44.5,71.53 40.64,71.53 R2.1
  Bottom 0.203: v98.35,40.03 97.13,38.81 96.52,38.81 IC1.18
N$3  (via drill 0.61)
  Top 0.203: v81.48,67.87 71.32,67.87 67.87,71.32 64.82,71.32 R3.1
  Bottom 0.203: v81.48,67.87 81.48,67.26 99.16,49.58 99.16,42.06 97.13,40.03 96.52,40.03 IC1.17
N$4  (via drill 0.61)
  Top 0.203: v98.35,42.47 98.35,50.6 89,59.94 89,71.32 R4.1
  Bottom 0.203: v98.35,42.47 97.33,41.45 96.52,41.45 IC1.16
N$5  (via drill 0.61)
  Top 0.203: v19.3,56.69 17.88,56.69 R5.1
  Bottom 0.203: v19.3,56.69 13.21,56.69 7.52,51 6.71,51 6.3,51.41 6.3,52.22 32.92,78.84 69.29,78.84 98.35,49.78 98.35,43.89 97.13,42.67 96.52,42.67 IC1.15
N$6  (via drill 0.61)
  Top 0.203: v40.64,62.59 R6.1 | v40.64,67.67 41.25,67.67 52.02,78.44 86.56,78.44 87.78,77.22 87.78,60.55 96.32,52.02 96.32,46.13 v94.69,44.5
  Bottom 0.203: v40.64,67.67 v40.64,62.59 | v94.69,44.5 95.1,44.5 95.71,43.89 96.32,43.89 IC1.14
N$7  (via drill 0.61)
  Top 0.203: v68.28,56.9 64.82,56.9 R7.1 | v93.27,51.41 93.27,47.14 v94.69,45.72
  Bottom 0.203: v68.28,56.9 70.71,54.46 90.22,54.46 v93.27,51.41 | v94.69,45.72 95.71,45.72 96.32,45.11 IC1.13
N$8  (via drill 0.61)
  Top 0.203: v94.69,46.94 94.69,51.21 93.67,52.22 93.47,52.22 89,56.69 R8.1
  Bottom 0.203: v94.69,46.94 95.91,46.94 96.32,46.53 IC1.12
N$9  (via drill 0.61)
  Top 0.203: v26.82,25.6 24.59,23.37 17.88,23.37 R9.1 | v43.89,25.6 45.31,25.6 49.99,30.28 v56.08,30.28 | v69.7,31.5 69.7,33.73 72.34,36.37 v78.23,36.37
  Bottom 0.203: v43.89,25.6 v26.82,25.6 | v56.08,30.28 57.91,30.28 58.52,30.89 69.09,30.89 v69.7,31.5 | v78.23,36.37 79.25,37.39 79.86,37.39 IC2.19
N$10  (via drill 0.61)
  Top 0.203: v42.27,23.16 40.64,23.16 R10.1 | v48.36,10.36 48.97,10.36 56.29,3.05 v58.12,3.05 | v83.52,15.24 78.03,15.24 v77.22,16.05
  Bottom 0.203: v42.27,23.16 42.27,16.46 v48.36,10.36 | v58.12,3.05 59.33,1.83 77.01,1.83 81.08,5.89 81.08,10.57 80.67,10.97 80.67,11.79 81.08,12.19 84.12,12.19 84.53,11.79 85.34,11.79 85.75,12.19 85.75,13.01 v83.52,15.24 | v77.22,16.05 77.22,19.51 75.18,21.54 75.18,35.56 78.23,38.61 79.86,38.61 IC2.18
N$11  (via drill 0.61)
  Top 0.203: v66.85,20.32 64.82,22.35 64.82,23.16 R11.1 | v72.54,30.28 72.54,33.93 v73.76,35.15
  Bottom 0.203: v66.85,20.32 69.7,23.16 69.7,27.43 v72.54,30.28 | v73.76,35.15 74.17,35.15 78.23,39.22 78.64,39.22 79.25,39.83 79.86,39.83 IC2.17
N$12  (via drill 0.61)
  Top 0.203: v81.89,36.98 81.89,35.76 82.7,34.95 82.7,32.11 83.52,31.29 85.34,31.29 87.58,29.06 87.58,24.38 87.99,23.98 88.19,23.98 88.8,23.37 R12.1 | v83.31,38 83.31,40.84 83.52,41.05 83.52,41.86 83.11,42.27 v81.69,42.27
  Bottom 0.203: v81.89,36.98 82.3,36.98 v83.31,38 | v81.69,42.27 80.87,41.45 80.06,41.45 IC2.16
N$13  (via drill 0.61)
  Top 0.203: v52.43,5.08 48.97,8.53 40.64,8.53 R13.1 | v71.12,15.65 v67.26,15.65
  Bottom 0.203: v52.43,5.08 56.69,5.08 v67.26,15.65 | v71.12,15.65 72.54,17.07 72.54,21.95 74.17,23.57 74.17,30.48 72.54,32.11 72.54,35.76 77.42,40.64 77.42,41.86 79.25,43.69 79.86,43.69 IC2.14
N$14  (via drill 0.61)
  Top 0.203: v57.3,1.42 49.17,9.55 39.62,9.55 39.42,9.35 39.42,2.85 38.41,1.83 33.93,1.83 27.23,8.53 17.88,8.53 R14.1 | v93.27,33.12 90.83,33.12 86.77,37.19 82.91,37.19 82.09,38 81.69,38 v78.23,41.45
  Bottom 0.203: v57.3,1.42 77.22,1.42 93.27,17.48 v93.27,33.12 | v78.23,41.45 79.25,42.47 79.86,42.47 IC2.15
N$15  (via drill 0.61)
  Top 0.203: v81.48,11.38 78.84,8.74 64.82,8.74 R15.1 | v91.64,35.97 90.63,35.97 v82.3,44.3
  Bottom 0.203: v81.48,11.38 85.55,11.38 91.64,17.48 v91.64,35.97 | v82.3,44.3 81.28,44.3 80.67,44.91 80.06,44.91 IC2.13
N$16  (via drill 0.61)
  Top 0.203: v84.94,12.6 88.8,8.74 R16.1 | v75.59,14.63 74.78,14.63 72.14,17.27 72.14,18.9 69.9,21.13 66.85,21.13 65.84,22.15 65.84,30.48 64.62,31.7 64.62,34.95 v65.23,35.56 | v68.07,36.58 68.07,37.59 72.95,42.47 v74.37,42.47
  Bottom 0.203: v84.94,12.6 77.62,12.6 v75.59,14.63 | v65.23,35.56 67.06,35.56 v68.07,36.58 | v74.37,42.47 74.78,42.47 78.64,46.33 79.86,46.33 IC2.12
N$17  (via drill 0.61)
  Top 0.203: v30.48,59.94 27.43,59.94 16.05,71.32 15.24,71.32 R17.1 | v54.46,52.63 54.46,49.58 57.3,46.74 57.3,46.13 60.96,42.47 v60.96,39.42
  Bottom 0.203: v30.48,59.94 36.37,54.05 51,54.05 52.83,52.22 54.05,52.22 v54.46,52.63 | v60.96,39.42 62.79,37.59 63.4,37.59 IC3.19
N$18  (via drill 0.61)
  Top 0.203: v39.22,70.1 39.22,70.31 38.2,71.32 R18.1 | v65.63,60.76 69.09,57.3 69.09,53.65 64.41,48.97 64.41,40.64 v65.84,39.22
  Bottom 0.203: v39.22,70.1 48.36,70.1 57.71,60.76 v65.63,60.76 | v65.84,39.22 64.01,39.22 63.6,38.81 IC3.18
N$19  (via drill 0.61)
  Top 0.203: v76.2,46.33 74.98,47.55 74.98,57.3 62.38,69.9 62.38,71.32 R19.1 | v73.15,43.28 71.32,43.28 v68.07,40.03
  Bottom 0.203: v73.15,43.28 v76.2,46.33 | v68.07,40.03 63.6,40.03 IC3.17
N$20  (via drill 0.61)
  Top 0.203: v75.39,60.35 86.36,71.32 R20.1 | v71.93,57.91 71.93,55.27 66.04,49.38 v66.04,43.28
  Bottom 0.203: v75.39,60.35 74.37,60.35 v71.93,57.91 | v66.04,43.28 64.21,41.45 63.6,41.45 IC3.16
N$21  (via drill 0.61)
  Top 0.203: R21.1 15.24,57.51 v16.05,58.32 | v58.52,62.38 58.52,61.77 61.16,59.13 61.16,49.38 62.38,48.16 62.38,47.14 v61.57,46.33
  Bottom 0.203: v16.05,58.32 29.06,71.32 46.33,71.32 46.74,70.92 49.99,70.92 v58.52,62.38 | v61.57,46.33 60.76,45.52 60.76,43.48 61.57,42.67 63.4,42.67 IC3.15
N$22  (via drill 0.61)
  Top 0.203: v43.08,66.24 38.2,61.37 38.2,56.9 R22.1 | v54.86,60.35 54.86,54.05 58.12,50.8 58.12,47.35 v61.57,43.89
  Bottom 0.203: v43.08,66.24 46.13,66.24 52.02,60.35 v54.86,60.35 | v61.57,43.89 63.4,43.89 IC3.14
N$23  (via drill 0.61)
  Top 0.203: v61.57,45.11 63.4,46.94 63.4,55.68 62.38,56.69 R23.1
  Bottom 0.203: v61.57,45.11 63.4,45.11 IC3.13
N$24  (via drill 0.61)
  Top 0.203: v85.14,58.12 86.36,56.9 R24.1 | v71.12,55.88 71.12,55.07 65.23,49.17 v65.23,46.53
  Bottom 0.203: v85.14,58.12 73.36,58.12 v71.12,55.88 | v65.23,46.53 63.6,46.53 IC3.12
N$25  (via drill 0.61)
  Top 0.203: v28.85,26.42 24.59,22.15 16.87,22.15 15.85,23.16 15.24,23.16 R25.1
  Bottom 0.203: v28.85,26.42 31.7,26.42 42.67,37.39 46.94,37.39 IC4.19
N$26  (via drill 0.61)
  Top 0.203: v47.75,29.87 40.23,29.87 39.42,29.06 39.42,24.38 39.01,23.98 38.81,23.98 38.2,23.37 R26.1
  Bottom 0.203: v47.75,29.87 47.75,35.15 48.36,35.76 48.36,38 47.75,38.61 46.94,38.61 IC4.18
N$27  (via drill 0.61)
  Top 0.203: v48.77,38.81 54.66,38.81 59.54,33.93 59.54,30.68 60.76,29.46 60.76,24.59 61.37,23.98 61.57,23.98 62.18,23.37 R27.1
  Bottom 0.203: v48.77,38.81 47.75,39.83 46.94,39.83 IC4.17
N$28  (via drill 0.61)
  Top 0.203: v84.94,29.87 84.94,24.59 85.55,23.98 85.75,23.98 86.36,23.37 R28.1 | v67.26,21.95 v76,21.95 | v48.97,21.74 v53.03,21.74 | v45.11,35.56 45.11,40.23 v44.7,40.64
  Bottom 0.203: v84.94,29.87 83.31,29.87 76,22.55 v76,21.95 | v67.26,21.95 55.07,21.95 54.86,21.74 v53.03,21.74 | v48.97,21.74 48.97,22.35 45.11,26.21 v45.11,35.56 | v44.7,40.64 45.11,40.64 45.72,41.25 46.94,41.25 IC4.16
N$29  (via drill 0.61)
  Top 0.203: v41.66,40.03 40.84,39.22 34.54,39.22 33.53,40.23 28.25,40.23 27.64,39.62 21.34,39.62 11.18,29.46 11.18,3.05 12.39,1.83 13.01,1.83 13.82,2.64 13.82,7.11 15.24,8.53 R29.1
  Bottom 0.203: v41.66,40.03 42.88,40.03 45.31,42.47 46.94,42.47 IC4.15
N$30  (via drill 0.61)
  Top 0.203: v38,12.39 38,8.74 R30.1 | v33.93,24.79 33.93,32.72 v31.5,35.15
  Bottom 0.203: v38,12.39 38,20.73 v33.93,24.79 | v31.5,35.15 32.51,35.15 34.14,36.78 34.14,40.44 34.54,40.84 35.36,40.84 35.56,40.64 41.05,40.64 41.25,40.84 43.08,40.84 45.92,43.69 46.94,43.69 IC4.14
N$31  (via drill 0.61)
  Top 0.203: v80.87,52.63 83.31,50.19 90.83,50.19 92.66,48.36 92.66,43.28 98.96,36.98 98.96,24.79 96.93,22.76 96.93,21.74 88.8,13.61 82.5,13.61 79.25,10.36 64.62,10.36 62.99,8.74 62.38,8.74 R31.1 | v51,55.27 51,54.66 48.77,52.43 v48.77,45.11
  Bottom 0.203: v80.87,52.63 73.76,52.63 73.36,52.22 71.12,52.22 68.07,55.27 v51,55.27 | v48.77,45.11 46.94,45.11 IC4.13
N$32  (via drill 0.61)
  Top 0.203: v72.34,7.92 78.64,7.92 80.26,9.55 84.73,9.55 85.55,8.74 86.36,8.74 R32.1 | v67.46,12.8 56.29,12.8 v47.75,21.34 | v44.3,36.58 44.3,38.61 v40.84,42.06 | v45.11,47.35 v43.89,46.13
  Bottom 0.203: v67.46,12.8 v72.34,7.92 | v47.75,21.34 47.75,22.96 44.3,26.42 v44.3,36.58 | v40.84,42.06 41.86,42.06 42.67,42.88 42.67,44.91 v43.89,46.13 | v45.11,47.35 45.92,46.53 46.94,46.53 IC4.12
N$33  (via drill 0.61)
  Top 0.203: v25.4,37.8 20.12,37.8 11.58,29.26 11.58,24.18 11.79,23.98 11.99,23.98 12.6,23.37 R33.1
  Bottom 0.203: v25.4,37.8 30.07,37.8 30.28,37.59 IC5.19
N$34  (via drill 0.61)
  Top 0.203: v32.31,37.39 30.68,35.76 30.68,26.82 34.14,23.37 35.56,23.37 R34.1
  Bottom 0.203: v32.31,37.39 31.09,38.61 30.48,38.61 IC5.18
N$35  (via drill 0.61)
  Top 0.203: v57.71,27.03 57.71,25.2 59.54,23.37 R35.1 | v55.68,29.06 49.38,29.06 42.47,22.15 34.34,22.15 27.64,28.85 27.64,38.41 v28.65,39.42
  Bottom 0.203: v55.68,29.06 v57.71,27.03 | v28.65,39.42 29.87,39.42 30.28,39.83 IC5.17
N$36  (via drill 0.61)
  Top 0.203: v81.48,23.16 83.72,23.16 R36.1 | v78.44,21.95 77.22,21.95 76.4,22.76 72.14,22.76 67.46,27.43 v66.65,27.43 | v58.93,30.07 58.93,30.48 57.3,32.11 57.3,34.54 55.47,36.37 47.95,36.37 45.92,34.34 37.59,34.34 v33.33,38.61
  Bottom 0.203: v81.48,23.16 79.65,23.16 v78.44,21.95 | v66.65,27.43 65.23,26.01 61.77,26.01 60.76,27.03 60.76,29.26 59.94,30.07 v58.93,30.07 | v33.33,38.61 33.33,39.62 31.7,41.25 30.48,41.25 IC5.16
N$37  (via drill 0.61)
  Top 0.203: v25.2,35.15 23.77,33.73 18.69,33.73 14.02,29.06 14.02,22.55 12.8,21.34 12.8,8.74 R37.1 | v28.85,35.15 28.85,35.97 v32.31,39.42
  Bottom 0.203: v28.85,35.15 v25.2,35.15 | v32.31,39.42 32.31,40.03 31.7,40.64 29.26,40.64 29.06,40.84 29.06,41.86 29.67,42.47 30.28,42.47 IC5.15
N$38  (via drill 0.61)
  Top 0.203: v14.63,21.74 27.64,8.74 35.56,8.74 R38.1 | v8.94,45.72 12.6,42.06 18.49,42.06 21.74,45.31 27.43,45.31 v28.65,44.09
  Bottom 0.203: v14.63,21.74 14.63,22.35 1.63,35.36 1.63,44.7 2.64,45.72 v8.94,45.72 | v28.65,44.09 30.07,44.09 30.28,43.89 IC5.14
N$39  (via drill 0.61)
  Top 0.203: v27.64,23.98 39.22,12.39 47.55,12.39 51.21,8.74 59.54,8.74 R39.1 | v26.01,32.72 26.01,37.19 26.21,37.39 v26.21,38.81
  Bottom 0.203: v27.64,23.98 27.23,23.98 26.01,25.2 v26.01,32.72 | v26.21,38.81 26.21,42.88 28.25,44.91 30.28,44.91 IC5.13
N$40  (via drill 0.61)
  Top 0.203: v82.3,8.74 83.72,8.74 R40.1 | v39.01,46.94 33.53,46.94 v33.12,46.53
  Bottom 0.203: v82.3,8.74 83.52,8.74 92.46,17.68 92.46,44.5 87.58,49.38 78.23,49.38 76.81,47.95 72.54,47.95 71.53,48.97 65.23,48.97 64.82,49.38 59.54,49.38 58.52,48.36 51.82,48.36 49.38,45.92 48.36,45.92 48.16,45.72 45.52,45.72 44.3,46.94 v39.01,46.94 | v33.12,46.53 30.48,46.53 IC5.12
N$41  (via drill 0.61)
  Top 0.203: v11.99,37.59 10.16,37.59 5.89,41.86 5.89,52.63 12.6,59.33 12.6,71.32 R41.1
  Bottom 0.203: v11.99,37.59 13.82,37.59 IC6.19
N$42  (via drill 0.61)
  Top 0.203: R42.1 35.56,62.59 31.7,58.73 18.09,58.73 17.68,59.13 13.01,59.13 6.3,52.43 6.3,42.06 9.55,38.81 v11.99,38.81
  Bottom 0.203: v11.99,38.81 13.82,38.81 IC6.18
N$43  (via drill 0.61)
  Top 0.203: v57.71,73.36 59.54,71.53 R43.1 | v7.11,51.82 7.11,44.5 v10.36,41.25
  Bottom 0.203: v57.71,73.36 28.65,73.36 v7.11,51.82 | v10.36,41.25 11.38,41.25 12.6,40.03 13.82,40.03 IC6.17
N$44  (via drill 0.61)
  Top 0.203: v67.26,72.54 68.28,71.53 83.72,71.53 R44.1 | v14.83,58.32 14.02,57.51 14.02,44.5 v15.65,42.88
  Bottom 0.203: v67.26,72.54 29.06,72.54 v14.83,58.32 | v15.65,42.88 15.65,42.47 14.63,41.45 14.02,41.45 IC6.16
N$45  (via drill 0.61)
  Top 0.203: v11.58,44.3 11.58,55.68 12.6,56.69 R45.1
  Bottom 0.203: v11.58,44.3 13.21,42.67 13.82,42.67 IC6.15
N$46  (via drill 0.61)
  Top 0.203: v17.27,43.89 30.07,56.69 35.56,56.69 R46.1
  Bottom 0.203: v17.27,43.89 14.02,43.89 IC6.14
N$47  (via drill 0.61)
  Top 0.203: v56.49,63.2 59.54,60.15 59.54,56.9 R47.1 | v17.27,58.32 16.46,57.51 16.46,49.58 15.04,48.16 15.04,45.52 v15.65,44.91
  Bottom 0.203: v56.49,63.2 55.88,63.2 48.56,70.51 40.03,70.51 39.62,70.92 29.87,70.92 v17.27,58.32 | v15.65,44.91 14.02,44.91 IC6.13
N$48  (via drill 0.61)
  Top 0.203: v86.16,60.76 83.92,58.52 83.92,56.9 R48.1 | v39.22,78.03 37.59,78.03 36.78,77.22 36.78,63.2 30.68,57.1 29.26,57.1 v18.49,46.33
  Bottom 0.203: v86.16,60.76 85.55,60.76 68.28,78.03 v39.22,78.03 | v18.49,46.33 14.02,46.33 IC6.12
N$49
  Top 0.203: R1.2 17.88,73.36 17.88,76.2 SV1.3
N$50
  Top 0.203: SV2.3 R2.2
N$51
  Top 0.203: R3.2 64.82,73.36 64.82,76.2 SV3.3
N$52
  Top 0.203: R4.2 89,73.36 89,76.2 SV4.3
N$53
  Top 0.203: R5.2 17.88,54.86 17.88,52.22 SV5.3
N$54
  Top 0.203: SV6.3 R6.2
N$55
  Top 0.203: R7.2 64.82,54.86 64.82,52.22 SV7.3
N$56
  Top 0.203: R8.2 89,54.86 89,52.22 SV8.3
N$57
  Top 0.203: SV1.2 R17.2
N$58
  Top 0.203: R18.2 38.2,73.36 38.2,76.2 SV2.2
N$59
  Top 0.203: R19.2 62.18,73.36 62.18,76.2 SV3.2
N$60
  Top 0.203: SV4.2 R20.2
N$61
  Top 0.203: SV5.2 R21.2
N$62
  Top 0.203: R22.2 38.2,54.86 38.2,52.22 SV6.2
N$63
  Top 0.203: R23.2 62.18,54.86 62.18,52.22 SV7.2
N$64
  Top 0.203: SV8.2 R24.2
N$65
  Top 0.203: R44.2 83.92,73.36 83.92,76.2 SV4.1
N$66
  Top 0.203: R43.2 59.74,73.36 59.74,76.2 SV3.1
N$67
  Top 0.203: SV2.1 R42.2
N$68
  Top 0.203: R41.2 12.8,73.36 12.8,76.2 SV1.1
N$69
  Top 0.203: R48.2 83.92,54.86 83.92,52.22 SV8.1
N$70
  Top 0.203: R9.2 17.88,25.2 17.88,27.84 SV9.3
N$71
  Top 0.203: R47.2 59.74,54.86 59.74,52.22 SV7.1
N$72
  Top 0.203: SV6.1 R46.2
N$73
  Top 0.203: R45.2 12.8,54.86 12.8,52.22 SV5.1
N$74
  Top 0.203: SV10.3 R10.2
N$75
  Top 0.203: R11.2 64.82,25.2 64.82,27.84 SV11.3
N$76
  Top 0.203: R12.2 89,25.2 89,27.84 SV12.3
N$77
  Top 0.203: SV12.2 R28.2
N$78
  Top 0.203: R27.2 62.18,25.2 62.18,27.84 SV11.2
N$79
  Top 0.203: R26.2 38.2,25.2 38.2,27.84 SV10.2
N$80
  Top 0.203: SV9.2 R25.2
N$81
  Top 0.203: R36.2 83.92,25.2 83.92,27.84 SV12.1
N$82
  Top 0.203: R35.2 59.74,25.2 59.74,27.84 SV11.1
N$83
  Top 0.203: SV10.1 R34.2
N$84
  Top 0.203: R33.2 12.8,25.2 12.8,27.84 SV9.1
N$85
  Top 0.203: R14.2 17.88,6.5 17.88,3.86 SV13.3
N$86
  Top 0.203: SV14.3 R13.2
N$87
  Top 0.203: R15.2 64.82,6.5 64.82,3.86 SV15.3
N$88
  Top 0.203: R16.2 89,6.5 89,3.86 SV16.3
N$89
  Top 0.203: SV16.2 R32.2
N$90
  Top 0.203: R31.2 62.18,6.5 62.18,3.86 SV15.2
N$91
  Top 0.203: R30.2 38.2,6.5 38.2,3.86 SV14.2
N$92
  Top 0.203: SV13.2 R29.2
N$93
  Top 0.203: R40.2 83.92,6.5 83.92,3.86 SV16.1
N$94
  Top 0.203: R39.2 59.74,6.5 59.74,3.86 SV15.1
N$95
  Top 0.203: SV14.1 R38.2
N$96
  Top 0.203: R37.2 12.8,6.5 12.8,3.86 SV13.1
N$97
  Top 0.203: U$2.COM 94.28,26.21 93.88,26.21 89.81,22.15 81.28,22.15 75.59,27.84 72.14,27.84 68.68,31.29 68.68,32.92 U$1.A5
N$98
  Bottom 0.203: 6.3,6.5 8.74,6.5 JP1.1 | 6.3,6.5 6.3,9.14 R53.2 | 6.3,6.5 Q1.3
N$99
  Bottom 0.203: 29.06,6.5 29.06,9.14 R54.2 | 29.06,6.5 31.7,6.5 JP2.1 | 29.06,6.5 Q2.3
N$100
  Bottom 0.203: 53.24,6.5 53.24,9.14 R55.2 | 53.24,6.5 55.88,6.5 JP3.1 | 53.24,6.5 Q3.3
N$101
  Bottom 0.203: 77.42,6.5 79.86,6.5 JP4.1 | 77.42,6.5 77.42,9.14 R56.2 | 77.42,6.5 Q4.3
N$102
  Bottom 0.203: Q1.1 4.06,5.49 5.08,6.5 5.08,7.92 3.86,9.14 R49.2
N$103
  Bottom 0.203: Q2.1 26.82,5.49 26.01,5.49 24.59,6.91 24.59,7.72 26.01,9.14 26.62,9.14 R50.2
N$104
  Bottom 0.203: Q3.1 51,5.49 52.02,6.5 52.02,7.92 50.8,9.14 R51.2
N$105
  Bottom 0.203: Q4.1 75.18,5.49 76.2,6.5 76.2,7.92 74.98,9.14 R52.2
N$106
  Top 0.203: U$1.D13 90.02,31.9 94.08,31.9 LED1.A
Q1  (via drill 0.61)
  Top 0.203: v73.36,28.65 77.01,28.65 81.28,32.92 U$1.A0
  Bottom 0.203: v73.36,28.65 70.1,25.4 70.1,17.27 57.1,4.27 43.48,4.27 40.23,1.02 6.1,1.02 2.44,4.67 2.44,9.75 3.66,10.97 R49.1
Q2  (via drill 0.61)
  Top 0.203: v36.58,20.93 42.47,20.93 49.78,28.25 50.6,28.25 51,27.84 51,27.64 52.22,26.42 52.43,26.42 53.65,25.2 53.65,24.99 54.66,23.98 55.68,23.98 v56.08,23.57 | v68.89,23.57 70.1,23.57 v70.92,22.76 | v76,23.98 v73.36,23.98
  Bottom 0.203: v36.58,20.93 26.82,11.18 R50.1 | v68.89,23.57 v56.08,23.57 | v70.92,22.76 72.14,22.76 v73.36,23.98 | v76,23.98 76,30.28 U$1.A1
Q3  (via drill 0.61)
  Top 0.203: v52.02,12.39 66.65,12.39 67.06,11.99 72.14,11.99 73.56,13.41 v78.64,13.41 | v82.3,27.64 82.3,34.14 81.69,34.75 77.83,34.75 76.2,33.12 U$1.A2
  Bottom 0.203: v52.02,12.39 50.8,11.18 R51.1 | v78.64,13.41 78.64,15.85 77.62,16.87 77.62,22.96 v82.3,27.64
Q4
  Bottom 0.203: U$1.A3 74.78,31.9 74.78,11.18 R52.1
VCC  (via drill 0.61)
  Top 0.203: v40.03,13.21 46.94,13.21 | 46.94,13.21 51.21,13.21 | 51.21,13.21 v53.24,13.21 | 51.21,13.21 51.21,11.99 51.61,11.58 72.34,11.58 73.15,12.39 v76.2,12.39 80.67,12.39 82.3,14.02 87.78,14.02 v94.28,20.52 | v50.19,27.43 50.19,24.99 46.94,21.74 46.94,13.21 | v32.31,36.17 35.15,36.17 37.39,33.93 v46.94,33.93 | U$2.L1 94.49,27.84 v94.49,30.28 89.61,30.28 87.78,32.11 87.78,33.73 85.34,36.17 v83.52,36.17 | IC7.6 52.63,68.07 53.24,68.07 54.05,68.89 54.05,70.92 51.41,73.56 49.78,73.56 48.77,72.54 C7.1 48.77,72.34 48.77,66.04 49.17,65.63 49.17,63.8 46.74,61.37 | 46.74,61.37 v46.74,52.22 v46.74,50.6 | 46.74,61.37 46.53,61.57 IC7.16 46.74,61.37
  Bottom 0.203: IC6.20 14.02,36.37 14.63,36.37 17.68,39.42 17.68,40.44 18.09,40.84 18.9,40.84 19.1,40.64 21.54,40.64 24.59,37.59 24.59,37.39 25.6,36.37 30.28,36.37 IC5.20 30.48,36.17 v32.31,36.17 | IC3.20 63.4,36.17 62.38,36.17 60.96,34.75 U$1.5V 60.96,32.92 60.35,32.92 58.73,31.29 54.05,31.29 v50.19,27.43 | 32.92,7.52 32.92,5.89 30.28,3.25 26.01,3.25 18.29,10.97 6.5,10.97 R53.1 | 32.92,7.52 29.26,11.18 R54.1 | v53.24,13.21 53.24,11.18 R55.1 | 32.92,7.52 34.34,7.52 v40.03,13.21 40.03,22.15 41.86,23.98 42.67,23.98 46.13,20.52 48.97,20.52 49.78,21.34 49.78,22.15 46.94,24.99 v46.94,33.93 IC4.20 | v76.2,12.39 77.42,11.18 R56.1 | 93.47,47.14 93.47,38.61 95.71,36.37 | 93.47,47.14 93.47,49.38 C1.1 | 95.71,36.37 96.32,36.37 IC1.20 95.71,36.37 | 95.71,36.37 94.49,35.15 v94.49,30.28 94.28,30.07 v94.28,20.52 | v83.52,36.17 80.06,36.17 IC2.20 | v46.74,50.6 46.53,50.6 45.52,49.58 C4.1 | 26.42,49.58 25.4,50.6 22.76,50.6 21.74,49.58 8.74,49.58 C6.1 | 56.9,49.58 59.13,49.58 59.33,49.78 67.26,49.78 67.67,49.38 71.53,49.38 72.75,50.6 74.78,50.6 75.79,49.58 C2.1 76,49.58 77.01,50.6 77.83,50.6 78.23,50.19 87.38,50.19 90.42,47.14 93.47,47.14 | 26.42,49.58 41.66,49.58 43.89,51.82 46.74,51.82 | 46.74,51.82 54.66,51.82 56.9,49.58 | 26.42,49.58 C5.1 | 56.9,49.58 C3.1 | 46.74,51.82 v46.74,52.22
Y0  (via drill 0.61)
  Top 0.203: v26.01,57.91 v15.85,47.75 | v45.11,60.55 45.11,62.18 45.72,62.79 46.33,62.79 IC7.15
  Bottom 0.203: v15.85,47.75 14.02,47.75 IC6.11 | v26.01,57.91 27.23,57.91 30.07,60.76 44.91,60.76 v45.11,60.55
Y1  (via drill 0.61)
  Top 0.203: v32.31,47.55 38.41,47.55 44.3,53.44 44.3,62.59 45.72,64.01 46.33,64.01 IC7.14
  Bottom 0.203: v32.31,47.55 30.48,47.55 IC5.11
Y2  (via drill 0.61)
  Top 0.203: v48.36,65.23 46.53,65.23 IC7.13 | v56.08,60.35 56.08,53.44 58.52,51 58.52,50.8 v61.57,47.75
  Bottom 0.203: v48.36,65.23 51.21,65.23 v56.08,60.35 | v61.57,47.75 63.4,47.75 IC3.11
Y3  (via drill 0.61)
  Top 0.203: v43.89,47.95 44.5,47.95 44.7,48.16 47.35,48.16 47.75,48.56 v47.75,60.55 | v44.7,65.43 45.92,66.65 46.33,66.65 IC7.12
  Bottom 0.203: v43.89,47.95 44.09,48.16 45.52,48.16 45.92,47.75 46.94,47.75 IC4.11 | v47.75,60.55 47.75,62.38 v44.7,65.43
Y4  (via drill 0.61)
  Top 0.203: v47.14,71.73 47.95,70.92 47.95,68.89 47.14,68.07 46.53,68.07 IC7.11 | v86.77,58.32 89.41,58.32 95.5,52.22 v95.5,48.77
  Bottom 0.203: v47.14,71.73 65.63,71.73 75.79,61.57 83.52,61.57 v86.77,58.32 | v95.5,48.77 96.52,47.75 IC1.11
Y5  (via drill 0.61)
  Top 0.203: v44.7,69.09 46.33,69.09 IC7.10 | v80.06,55.27 80.06,49.38 v81.69,47.75
  Bottom 0.203: v44.7,69.09 48.77,69.09 57.91,59.94 66.45,59.94 70.31,56.08 70.31,55.47 70.71,55.07 79.86,55.07 v80.06,55.27 | v81.69,47.75 80.06,47.75 IC2.11

### Text on the board
tValues: V2.0 | Cube RGB 4x4x4 | Dylan Collaud